# Altium schematic sheet InkJetFin - InkJet Cartridge Interface.SchDoc
size A
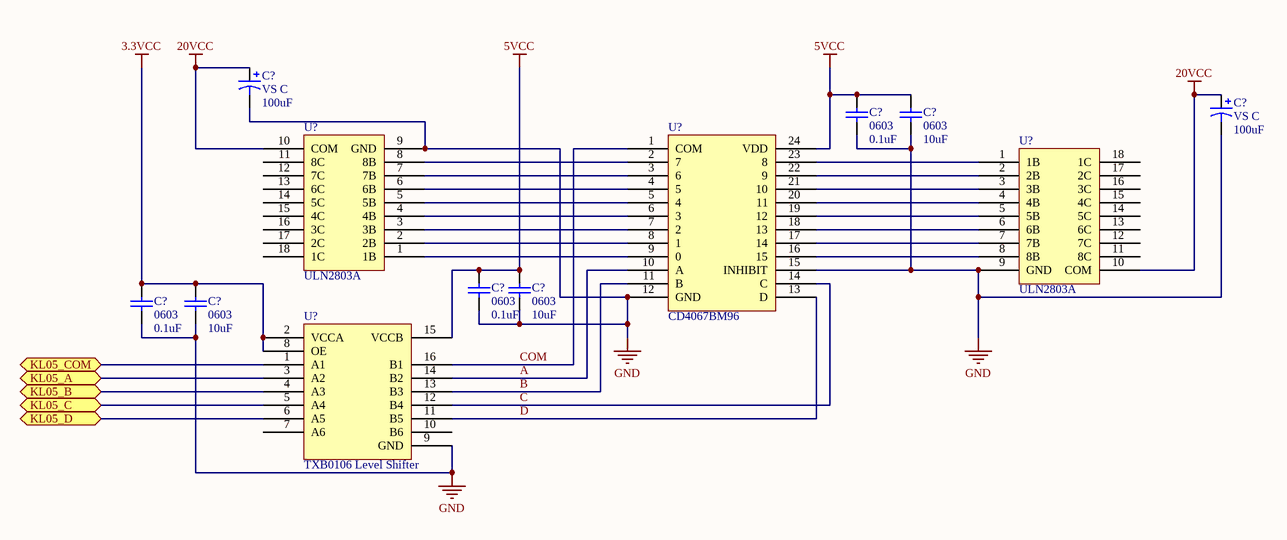
[diagram p0: InkJetFin - InkJet Cartridge Interface.SchDoc]

## Parts
(Parts that share a designator on the sheet are numbered #1, #2 ... from top to bottom, then left to right.)
C?#1  VS C  value 100uF  [Panasonic VS C]
C?#2  VS C  value 100uF  [Panasonic VS C]
C?#3  0603  value 0.1uF  [1608[0603]]
C?#4  0603  value 10uF  [1608[0603]]
C?#5  0603  value 0.1uF  [1608[0603]]
C?#6  0603  value 10uF  [1608[0603]]
C?#7  0603  value 0.1uF  [1608[0603]]
C?#8  0603  value 10uF  [1608[0603]]
U?#1  ULN2803A  [SOIC127P1030X265-18N]
U?#2  CD4067BM96  [TSOP65P640X120-24N]
U?#3  ULN2803A  [SOIC127P1030X265-18N]
U?#4  TXB0106 Level Shifter  [TSOP65P640X120-16N]

## Ports
KL05_A, KL05_B, KL05_C, KL05_COM, KL05_D

## Nets
3.3VCC: C?#7.2 C?#8.2 U?#4.2(VCCA) U?#4.8(OE)
5VCC: C?#3.2 C?#4.2 C?#5.2 C?#6.2 U?#2.24(VDD) U?#4.15(VCCB)
20VCC: C?#1.1 C?#2.1 U?#1.10(COM) U?#3.10(COM)
GND: C?#1.2 C?#2.2 C?#3.1 C?#4.1 C?#5.1 C?#6.1 C?#7.1 C?#8.1 U?#1.9(GND) U?#2.12(GND) U?#2.15(INHIBIT) U?#3.9(GND) U?#4.9(GND)
A: U?#2.10(A) U?#4.14(B2)
B: U?#2.11(B) U?#4.13(B3)
C: U?#2.14(C) U?#4.12(B4)
COM: U?#2.1(COM) U?#4.16(B1)
D: U?#2.13(D) U?#4.11(B5)
KL05_A: U?#4.3(A2) ; port KL05_A
KL05_B: U?#4.4(A3) ; port KL05_B
KL05_C: U?#4.5(A4) ; port KL05_C
KL05_COM: U?#4.1(A1) ; port KL05_COM
KL05_D: U?#4.6(A5) ; port KL05_D
NetU?#1_1: U?#1.1(1B) U?#2.9(0)
NetU?#1_2: U?#1.2(2B) U?#2.8(1)
NetU?#1_3: U?#1.3(3B) U?#2.7(2)
NetU?#1_4: U?#1.4(4B) U?#2.6(3)
NetU?#1_5: U?#1.5(5B) U?#2.5(4)
NetU?#1_6: U?#1.6(6B) U?#2.4(5)
NetU?#1_7: U?#1.7(7B) U?#2.3(6)
NetU?#1_8: U?#1.8(8B) U?#2.2(7)
NetU?#2_16: U?#2.16(15) U?#3.8(8B)
NetU?#2_17: U?#2.17(14) U?#3.7(7B)
NetU?#2_18: U?#2.18(13) U?#3.6(6B)
NetU?#2_19: U?#2.19(12) U?#3.5(5B)
NetU?#2_20: U?#2.20(11) U?#3.4(4B)
NetU?#2_21: U?#2.21(10) U?#3.3(3B)
NetU?#2_22: U?#2.22(9) U?#3.2(2B)
NetU?#2_23: U?#2.23(8) U?#3.1(1B)

Not connected (* = marked no-connect by the designer): U?#1 11(8C) 12(7C) 13(6C) 14(5C) 15(4C) 16(3C) 17(2C) 18(1C); U?#3 11(8C) 12(7C) 13(6C) 14(5C) 15(4C) 16(3C) 17(2C) 18(1C); U?#4 7(A6) 10(B6)

## Library data of the parts
C?#1 C?#2 = Cap Pol1: Polarized Capacitor (Radial); Published: 8-Jun-2000; LatestRevisionDate: 17-Jul-2002; LatestRevisionNote: Re-released for DXP Platform.; PackageReference: RB7.6-15; Publisher: Altium Limited; PackageDescription: Polarized Capacitor (Radial); 2 Leads
C?#3-C?#8 = Cap Semi: Capacitor (Semiconductor SIM Model); Published: 8-Jun-2000; LatestRevisionDate: 29-May-2009; LatestRevisionNote: IPC-7351 Footprint Added.; PackageReference: C1206; Publisher: Altium Limited; PackageDescription: Chip Capacitor
U?#1 U?#3 = Ti ULN2803A
U?#2 = Ti CD4067BM96
U?#4 = TXB0106: TXB0106 - Bidriectional Opendrain/pushpull level shift